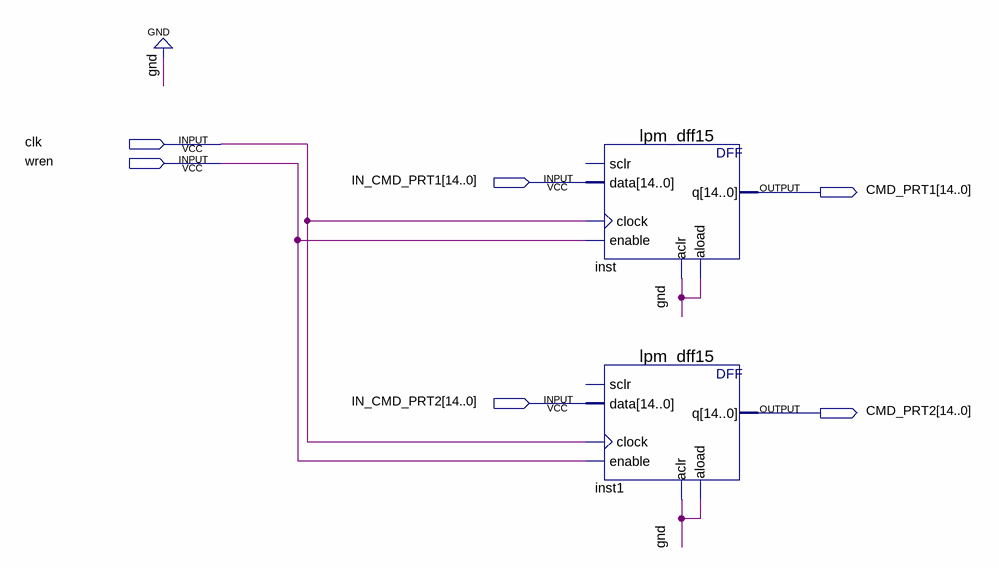
[diagram p0: schematic sheet]
// Quartus schematic CMD_BUFFER.bdf as structural Verilog: 2 symbols, 6 pins
module CMD_BUFFER (
  input  clk,
  input  wren,
  input  [14:0] IN_CMD_PRT1,
  input  [14:0] IN_CMD_PRT2,
  output [14:0] CMD_PRT1,
  output [14:0] CMD_PRT2
);

  lpm_dff15 inst (
    .data(IN_CMD_PRT1), .clock(clk), .enable(wren), .aclr(1'b0), .aload(1'b0), .q(CMD_PRT1));  // open: sclr
  lpm_dff15 inst1 (
    .data(IN_CMD_PRT2), .clock(clk), .enable(wren), .aclr(1'b0), .aload(1'b0), .q(CMD_PRT2));  // open: sclr
endmodule
